# Altium schematic sheet CTRL.SchDoc
size A4; DrawnBy: Jakov Sola; Organization: KU Leuven; SheetNumber: 2; SheetTotal: 6
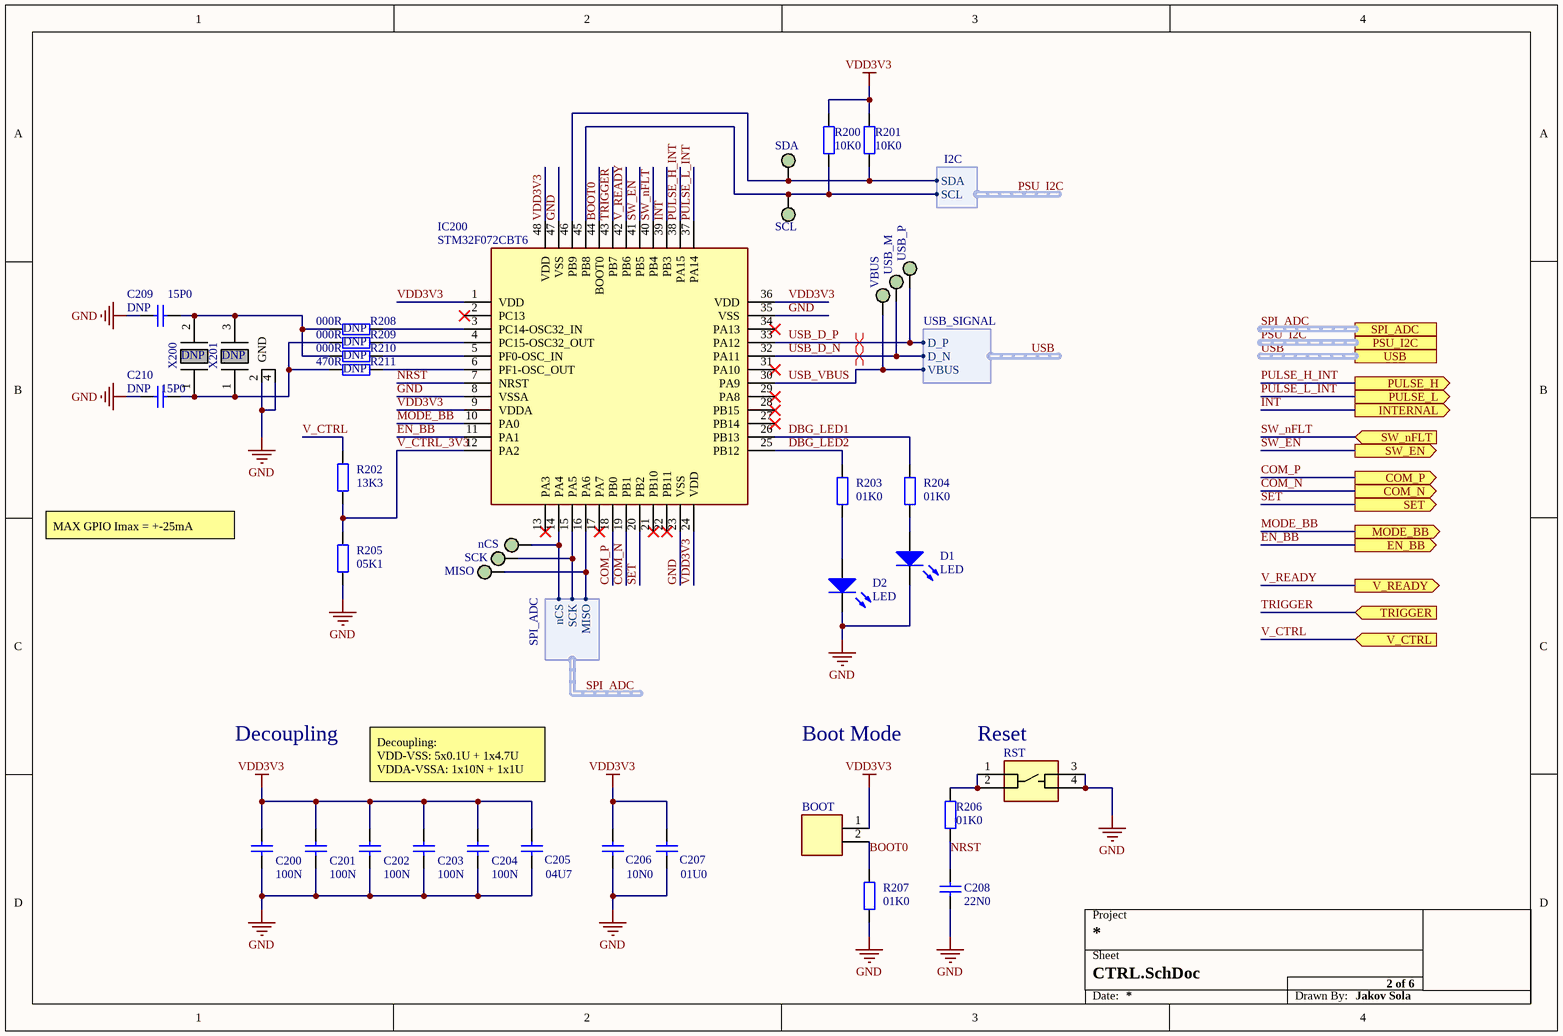
[diagram p0: CTRL.SchDoc]

## Parts
BOOT  CON_2P  [2MMHBS02VT02HTB]  (value not drawn)
C200  VALUE_4C: 100N  [CAPC0603N]  (hidden comment: Cap)
C201  VALUE_4C: 100N  [CAPC0603N]  (hidden comment: Cap)
C202  VALUE_4C: 100N  [CAPC0603N]  (hidden comment: Cap)
C203  VALUE_4C: 100N  [CAPC0603N]  (hidden comment: Cap)
C204  VALUE_4C: 100N  [CAPC0603N]  (hidden comment: Cap)
C205  VALUE_4C: 04U7  [CAPC1206N]  (hidden comment: Cap)
C206  VALUE_4C: 10N0  [CAPC0603N]  (hidden comment: Cap)
C207  VALUE_4C: 01U0  [CAPC0603N]  (hidden comment: Cap)
C208  VALUE_4C: 22N0  [CAPC0603N]  (hidden comment: Cap)
C209  POPULATE: DNP  VALUE_4C: 15P0  [CAPC0603N]  (hidden comment: Cap)
C210  POPULATE: DNP  VALUE_4C: 15P0  [CAPC0603N]  (hidden comment: Cap)
D1  LED  [LED0603_GREEN]
D2  LED  [LED0603_GREEN]
IC200  MANUFCODE: STM32F072CBT6  [LQFP48]  (hidden comment: STM32F0)
MISO  TP  [TP]  (value not drawn)
nCS  TP  [TP]  (value not drawn)
R200  VALUE_4C: 10K0  [RESC0603N]  (hidden comment: Res)
R201  VALUE_4C: 10K0  [RESC0603N]  (hidden comment: Res)
R202  VALUE_4C: 13K3  [RESC0603N]  (hidden comment: Res)
R203  VALUE_4C: 01K0  [RESC0603N]  (hidden comment: Res)
R204  VALUE_4C: 01K0  [RESC0603N]  (hidden comment: Res)
R205  VALUE_4C: 05K1  [RESC0603N]  (hidden comment: Res)
R206  VALUE_4C: 01K0  [RESC0603N]  (hidden comment: Res)
R207  VALUE_4C: 01K0  [RESC0603N]  (hidden comment: Res)
R208  POPULATE: DNP  VALUE_4C: 000R  [RESC0603N]  (hidden comment: Res)
R209  POPULATE: DNP  VALUE_4C: 000R  [RESC0603N]  (hidden comment: Res)
R210  POPULATE: DNP  VALUE_4C: 000R  [RESC0603N]  (hidden comment: Res)
R211  POPULATE: DNP  VALUE_4C: 470R  [RESC0603N]  (hidden comment: Res)
RST  4P_BTN  [FSM2J_1]  (value not drawn)
SCK  TP  [TP]  (value not drawn)
SCL  TP  [TP]  (value not drawn)
SDA  TP  [TP]  (value not drawn)
USB_M  TP  [TP]  (value not drawn)
USB_P  TP  [TP]  (value not drawn)
VBUS  TP  [TP]  (value not drawn)
X200  POPULATE: DNP  [XTAL_ABS07-32.768KHZ-7-T]  (hidden comment: CRY_2P)
X201  POPULATE: DNP  [FC3BAEBDI80T1]  (hidden comment: CRY_4P)

## Ports
COM_N (out), COM_P (out), EN_BB (out), INTERNAL (out), MODE_BB (out), PSU_I2C (harness I2C), PULSE_H (out), PULSE_L (out), SET (out), SPI_ADC (harness SPI_ADC), SW_EN (out), SW_nFLT (in), TRIGGER (in), USB (harness USB_SIGNAL), V_CTRL (in), V_READY (out)

## Harnesses
SPI_ADC: nCS, SCK, MISO
USB_SIGNAL: D_P, D_N, VBUS
I2C: SCL, SDA

## Nets
GND: C200.1 C201.1 C202.1 C203.1 C204.1 C205.1 C206.1 C207.1 C208.1 C209.1 C210.1 D1.2(K) D2.2(K) IC200.8(VSSA) IC200.23(VSS) IC200.35(VSS) IC200.47(VSS) R205.1 R207.1 RST.3 RST.4 X201.2(GND) X201.4(GND)
VDD3V3: BOOT.1 C200.2 C201.2 C202.2 C203.2 C204.2 C205.2 C206.2 C207.2 IC200.1(VDD) IC200.9(VDDA) IC200.24(VDD) IC200.36(VDD) IC200.48(VDD) R200.2 R201.2
BOOT0: BOOT.2 IC200.44(BOOT0) R207.2
COM_N: IC200.19(PB1) ; port COM_N
COM_P: IC200.18(PB0) ; port COM_P
DBG_LED1: IC200.26(PB13) R204.2
DBG_LED2: IC200.25(PB12) R203.2
EN_BB: IC200.11(PA1) ; port EN_BB
INT: IC200.39(PB3) ; port INTERNAL
MODE_BB: IC200.10(PA0) ; port MODE_BB
NRST: C208.2 IC200.7(NRST) R206.1
PSU_I2C.SCL: IC200.45(PB8) R200.1 SCL.TP ; port PSU_I2C.SCL
PSU_I2C.SDA: IC200.46(PB9) R201.1 SDA.TP ; port PSU_I2C.SDA
PULSE_H_INT: IC200.38(PA15) ; port PULSE_H
PULSE_L_INT: IC200.37(PA14) ; port PULSE_L
SET: IC200.20(PB2) ; port SET
SPI_ADC.MISO: IC200.16(PA6) MISO.TP ; port SPI_ADC.MISO
SPI_ADC.nCS: IC200.14(PA4) nCS.TP ; port SPI_ADC.nCS
SPI_ADC.SCK: IC200.15(PA5) SCK.TP ; port SPI_ADC.SCK
SW_EN: IC200.41(PB5) ; port SW_EN
SW_nFLT: IC200.40(PB4) ; port SW_nFLT
TRIGGER: IC200.43(PB7) ; port TRIGGER
USB_D_N: IC200.32(PA11) USB_M.TP ; port USB.D_N  [project net USB.D_N]
USB_D_P: IC200.33(PA12) USB_P.TP ; port USB.D_P  [project net USB.D_P]
USB_VBUS: IC200.30(PA9) VBUS.TP ; port USB.VBUS  [project net USB.VBUS]
V_CTRL: R202.2 ; port V_CTRL
V_CTRL_3V3: IC200.12(PA2) R202.1 R205.2
V_READY: IC200.42(PB6) ; port V_READY
NetC209_2: C209.2 R208.1 R210.1 X200.2(CRYSTAL_2) X201.3(CRYSTAL_2)
NetC210_2: C210.2 R209.1 R211.1 X200.1(CRYSTAL_1) X201.1(CRYSTAL_1)
NetD1_1: D1.1(A) R204.1
NetD2_1: D2.1(A) R203.1
NetIC200_3: IC200.3(PC14-OSC32_IN) R208.2
NetIC200_4: IC200.4(PC15-OSC32_OUT) R209.2
NetIC200_5: IC200.5(PF0-OSC_IN) R210.2
NetIC200_6: IC200.6(PF1-OSC_OUT) R211.2
NetR206_2: R206.2 RST.1 RST.2

Not connected (* = marked no-connect by the designer): IC200 2(PC13)* 13(PA3)* 17(PA7)* 21(PB10)* 22(PB11)* 27(PB14)* 28(PB15)* 29(PA8)* 31(PA10)* 34(PA13)*

## Buses and harness runs
harness PSU_I2C = port PSU_I2C
harness SPI_ADC = port SPI_ADC
harness USB = port USB

## Layout directives
differential pair: USB.D_N, USB.D_P

## Notes on the sheet
- MAX GPIO Imax = +-25mA
- Decoupling
- Decoupling:
  VDD-VSS: 5x0.1U + 1x4.7U
  VDDA-VSSA: 1x10N + 1x1U
- Boot Mode
- (near RST) Reset
- Project
- Sheet
- Date:
- Drawn By:

## Library data of the parts
BOOT = 2MM-HB-S02-VT-02-H-TB: MANUF: TE CONNECTIVITY; DESCR: CON 2P 2MM HEADER; VENDOR: MOUSER; VENDORCODE: 571-2MM-HBS02VT02HTB; POPULATE: YES; MANUFCODE: 2MM-HB-S02-VT-02-H-TB
C200-C204 = CL10B104KA8WPNC: MANUF: SAMSUNG; DESCR: CAP 100N 0603 25V X7R 10%; VENDOR: DIGI-KEY; VENDORCODE: 1276-6717-1-ND; POPULATE: YES; VALUE: 100N; VOLTAGE: 25V; TOLERANCE: 0.1; MANUFCODE: CL10B104KA8WPNC; PACKAGE: 0603; TECHNOLOGY: X7R
C205 = CL31B475KBHNNNE: MANUF: SAMSUNG; DESCR: CAP 04U7 1206 50V X7R 10%; VENDOR: FARNELL INONE; VENDORCODE: 3013533; POPULATE: YES; VALUE_PF: 4700000; VALUE: 04U7; VOLTAGE: 50V; TOLERANCE: 0.1; MANUFCODE: CL31B475KBHNNNE; PACKAGE: 1206; TECHNOLOGY: X7R
C206 = C0603C103K8RACTU: MANUF: KEMET; DESCR: CAP 10N0 0603 10V X7R 10%; VENDOR: DIGI-KEY; VENDORCODE: 399-11132-1-ND; POPULATE: YES; VALUE: 10N; VOLTAGE: 10V; TOLERANCE: 0.1; MANUFCODE: C0603C103K8RACTU; PACKAGE: 0603; TECHNOLOGY: X7R
C207 = C0603C105K4PAC-TU: MANUF: KEMET; DESCR: CAP 01U0 0603 16V X5R 10%; VENDOR: FARNELL INONE; VENDORCODE: 1463388; POPULATE: YES; VALUE_PF: 1000000; VOLTAGE: 16V; TOLERANCE: 0.1; MANUFCODE: C0603C105K4PAC-TU; PACKAGE: 0603; TECHNOLOGY: X5R
C208 = C0603C223K8RAC7867: MANUF: KEMET; DESCR: CAP 22N0 0603 10V X7R 10%; VENDOR: DIGI-KEY; VENDORCODE: 399-14505-1-ND; POPULATE: YES; VALUE: 22N; VOLTAGE: 10V; TOLERANCE: 0.1; MANUFCODE: C0603C223K8RAC7867; PACKAGE: 0603; TECHNOLOGY: X7R
C209 C210 = C0603C150K8RAC: MANUF: KEMET; DESCR: CAP 15P0 0603 10V X7R 10%; VALUE_PF: 15; VALUE: 15P; VOLTAGE: 10V; TOLERANCE: 0.1; MANUFCODE: C0603C150K8RAC; PACKAGE: 0603; TECHNOLOGY: X7R
D1 D2 = ASMT-RF45: MANUF: AVAGO TECHNOLOGIES; DESCR: LED GREEN 0603 20MA 2.4V 60MCD; VENDOR: FARNELL INONE; VENDORCODE: 1652078; POPULATE: YES; REMARK: GREEN; IF: 20MA; VF: 2.4V; INTENSITY: 60MCD; MANUFCODE: ASMT-RF45; QTY: SINGLE; COLOR: GREEN; PACKAGE: 0603
IC200 = STM32F072CBT6: MANUF: STM; DESCR: IC MCU ARM CORTEX-M0 128KB 48MHZ USB; VENDOR: FARNELL; VENDORCODE: 2432094; POPULATE: YES
MISO nCS SCK SCL SDA USB_M USB_P VBUS = TP: DESCR: TESTPOINT 1.5MM; POPULATE: NA; MANUFCODE: TP
R200 R201 = CRCW060310K0FKEA: Resistor; MANUF: VISHAY; DESCR: RES 10K0 0603 0.1W 1% 75V 100PPM; VENDOR: DIGI-KEY; VENDORCODE: 541-10.0KHCT-ND; POPULATE: YES; VALUE_MOHM: 10000000; VALUE: 10K; POWER: 0.1W; TOLERANCE: 1%; VOLTAGE: 75V; TEMPCOEFF: 100PPM; NPOWER: 0.1; NTOLERANCE: 0.01; NVOLTAGE: 75; NTEMPCOEFF: 100; MANUFCODE: CRCW060310K0FKEA; PACKAGE: 0603; NVALUE: 10000000
R202 = CRCW060313K3FKEA: Resistor; MANUF: VISHAY; DESCR: RES 13K3 0603 0.1W 1% 75V 100PPM; VENDOR: FARNELL INONE; VENDORCODE: 1652840; POPULATE: YES; VALUE_MOHM: 13300000; VALUE: 13K3; POWER: 0.1W; TOLERANCE: 1%; VOLTAGE: 75V; TEMPCOEFF: 100PPM; NPOWER: 0.1; NTOLERANCE: 0.01; NVOLTAGE: 75; NTEMPCOEFF: 100; MANUFCODE: CRCW060313K3FKEA; PACKAGE: 0603; NVALUE: 13300000
R203 R204 R206 R207 = MC 0.063W 0603 1% 1K: Resistor; MANUF: MULTICOMP; DESCR: RES 01K0 0603 0.063W 1% 50V 100PPM; VENDOR: FARNELL INONE; VENDORCODE: 9330380; POPULATE: YES; VALUE_MOHM: 1000000; VALUE: 1K; POWER: 0.063W; TOLERANCE: 1%; VOLTAGE: 50V; TEMPCOEFF: 100PPM; NPOWER: 0.063; NTOLERANCE: 0.01; NVOLTAGE: 50; NTEMPCOEFF: 100; MANUFCODE: MC 0.063W 0603 1% 1K; PACKAGE: 0603; NVALUE: 1000000
R205 = RC0603FR-075K1L: Resistor; MANUF: YAGEO; DESCR: RES 05K1 0603 0.1W 1% 75V 100PPM; VENDOR: DIGI-KEY; VENDORCODE: 311-5.10KHRCT-ND; POPULATE: YES; VALUE_MOHM: 5100000; VALUE: 5K1; POWER: 0.1W; TOLERANCE: 1%; VOLTAGE: 75V; TEMPCOEFF: 100PPM; NVOLTAGE: 75; NTEMPCOEFF: 100; MANUFCODE: RC0603FR-075K1L; PACKAGE: 603; NVALUE: 5100000
R208-R210 = CRCW06030000Z0EA: Resistor; MANUF: VISHAY; DESCR: RES 000R 0603 0.1W 1% 75V 100PPM; VENDOR: DIGI-KEY; VENDORCODE: 541-0.0GTR-ND; VALUE_MOHM: 0; VALUE: 000R; POWER: 0.1W; TOLERANCE: 1%; VOLTAGE: 75V; TEMPCOEFF: 100PPM; NPOWER: 0.1; NTOLERANCE: 0.01; NVOLTAGE: 75; NTEMPCOEFF: 100; MANUFCODE: CRCW06030000Z0EA; PACKAGE: 0603; NVALUE: 0
R211 = ERA3AEB471V: Resistor; MANUF: PANASONIC; DESCR: RES 470R 0603 0.1W 0.1% 75V 25PPM; VENDOR: FARNELL INONE; VENDORCODE: 1577601; VALUE_MOHM: 470000; VALUE: 470R; POWER: 0.1W; TOLERANCE: 0.1%; VOLTAGE: 75V; TEMPCOEFF: 25PPM; NPOWER: 0.1; NTOLERANCE: 0.001; NVOLTAGE: 75; NTEMPCOEFF: 25; MANUFCODE: ERA3AEB471V; PACKAGE: 0603; NVALUE: 470000
RST = FSM2JSMAATR: MANUF: TE CONNECTIVITY; DESCR: BTN 24V 4P SMD; VENDOR: MOUSER; VENDORCODE: 506-FSM2JSMAATR; POPULATE: YES; MANUFCODE: FSM2JSMAATR
X200 = ABS07-32.768KHZ-7-T: MANUF: ABRACON; DESCR: CRYSTAL 32.768KHZ 7PF 20PPM SMD; VENDOR: MOUSER; VENDORCODE: 815-ABS07-32.768K7T; MANUFCODE: ABS07-32.768KHZ-7-T
X201 = FC3BAEBDI8.0-T1: MANUF: ABRACON; DESCR: CRYSTAL 8MHZ 8PF 20PPM SMD; VENDOR: MOUSER; VENDORCODE: 815-FC3BAEBDI8.0-T1; MANUFCODE: FC3BAEBDI8.0-T1